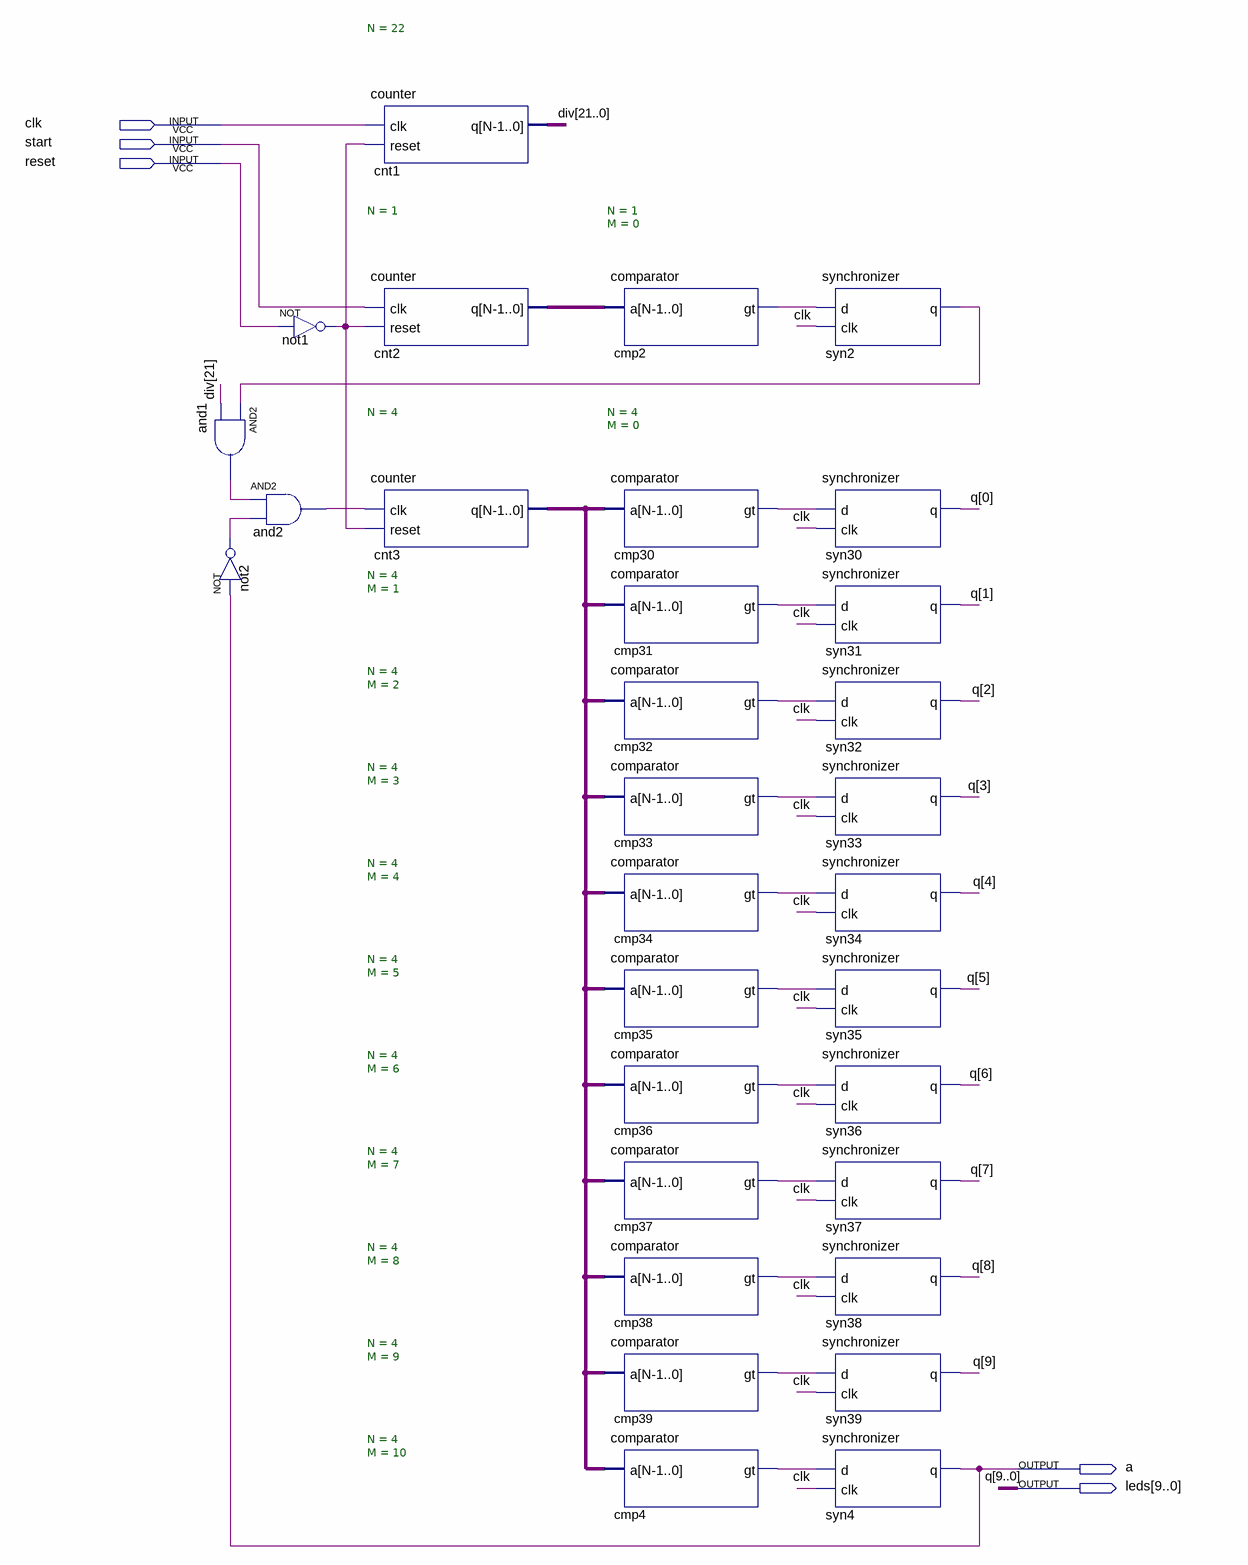
[diagram p0: schematic sheet]
// Quartus schematic animator.bdf as structural Verilog: 31 symbols, 5 pins
module animator (
  input  clk,
  input  start,
  input  reset,
  output a,
  output [9:0] leds
);

  wire and1_out, and2_out, cmp2_gt, cmp4_gt, cmp30_gt, cmp31_gt, cmp32_gt, cmp33_gt, cmp34_gt, cmp35_gt,
       cmp36_gt, cmp37_gt, cmp38_gt, cmp39_gt, cnt2_q, not1_out, not2_out, syn2_q;
  wire [3:0] cnt3_q;
  wire [21:0] div;

  and and1 (and1_out, syn2_q, div[21]);
  not not2 (not2_out, a);
  not not1 (not1_out, reset);
  and and2 (and2_out, and1_out, not2_out);
  counter #(.N(22)) cnt1 (.clk(clk), .reset(not1_out), .q(div));
  counter #(.N(1)) cnt2 (.clk(start), .reset(not1_out), .q(cnt2_q));
  counter #(.N(4)) cnt3 (.clk(and2_out), .reset(not1_out), .q(cnt3_q));
  comparator #(.N(1), .M(0)) cmp2 (.a(cnt2_q), .gt(cmp2_gt));
  comparator #(.N(4), .M(0)) cmp30 (.a(cnt3_q), .gt(cmp30_gt));
  comparator #(.N(4), .M(1)) cmp31 (.a(cnt3_q), .gt(cmp31_gt));
  comparator #(.N(4), .M(2)) cmp32 (.a(cnt3_q), .gt(cmp32_gt));
  comparator #(.N(4), .M(3)) cmp33 (.a(cnt3_q), .gt(cmp33_gt));
  comparator #(.N(4), .M(4)) cmp34 (.a(cnt3_q), .gt(cmp34_gt));
  comparator #(.N(4), .M(5)) cmp35 (.a(cnt3_q), .gt(cmp35_gt));
  comparator #(.N(4), .M(6)) cmp36 (.a(cnt3_q), .gt(cmp36_gt));
  comparator #(.N(4), .M(7)) cmp37 (.a(cnt3_q), .gt(cmp37_gt));
  comparator #(.N(4), .M(8)) cmp38 (.a(cnt3_q), .gt(cmp38_gt));
  comparator #(.N(4), .M(9)) cmp39 (.a(cnt3_q), .gt(cmp39_gt));
  comparator #(.N(4), .M(10)) cmp4 (.a(cnt3_q), .gt(cmp4_gt));
  synchronizer syn2 (.d(cmp2_gt), .clk(clk), .q(syn2_q));
  synchronizer syn30 (.d(cmp30_gt), .clk(clk), .q(leds[0]));
  synchronizer syn31 (.d(cmp31_gt), .clk(clk), .q(leds[1]));
  synchronizer syn32 (.d(cmp32_gt), .clk(clk), .q(leds[2]));
  synchronizer syn33 (.d(cmp33_gt), .clk(clk), .q(leds[3]));
  synchronizer syn34 (.d(cmp34_gt), .clk(clk), .q(leds[4]));
  synchronizer syn35 (.d(cmp35_gt), .clk(clk), .q(leds[5]));
  synchronizer syn36 (.d(cmp36_gt), .clk(clk), .q(leds[6]));
  synchronizer syn37 (.d(cmp37_gt), .clk(clk), .q(leds[7]));
  synchronizer syn38 (.d(cmp38_gt), .clk(clk), .q(leds[8]));
  synchronizer syn39 (.d(cmp39_gt), .clk(clk), .q(leds[9]));
  synchronizer syn4 (.d(cmp4_gt), .clk(clk), .q(a));

  // Other names for the same wires on the sheet: q[9:0] = leds
endmodule
